# Altium schematic sheet CW308T_XMEGA_Connector.SchDoc: CW308 Connections
size Letter; Organization: NewAE Technology Inc.; Address1: 1083 Queen St., Suite 196; Address2: Halifax; Address3: NS; Address4: Canada B3H 0B2; SheetNumber: 2; SheetTotal: 2; SheetApproved: YES
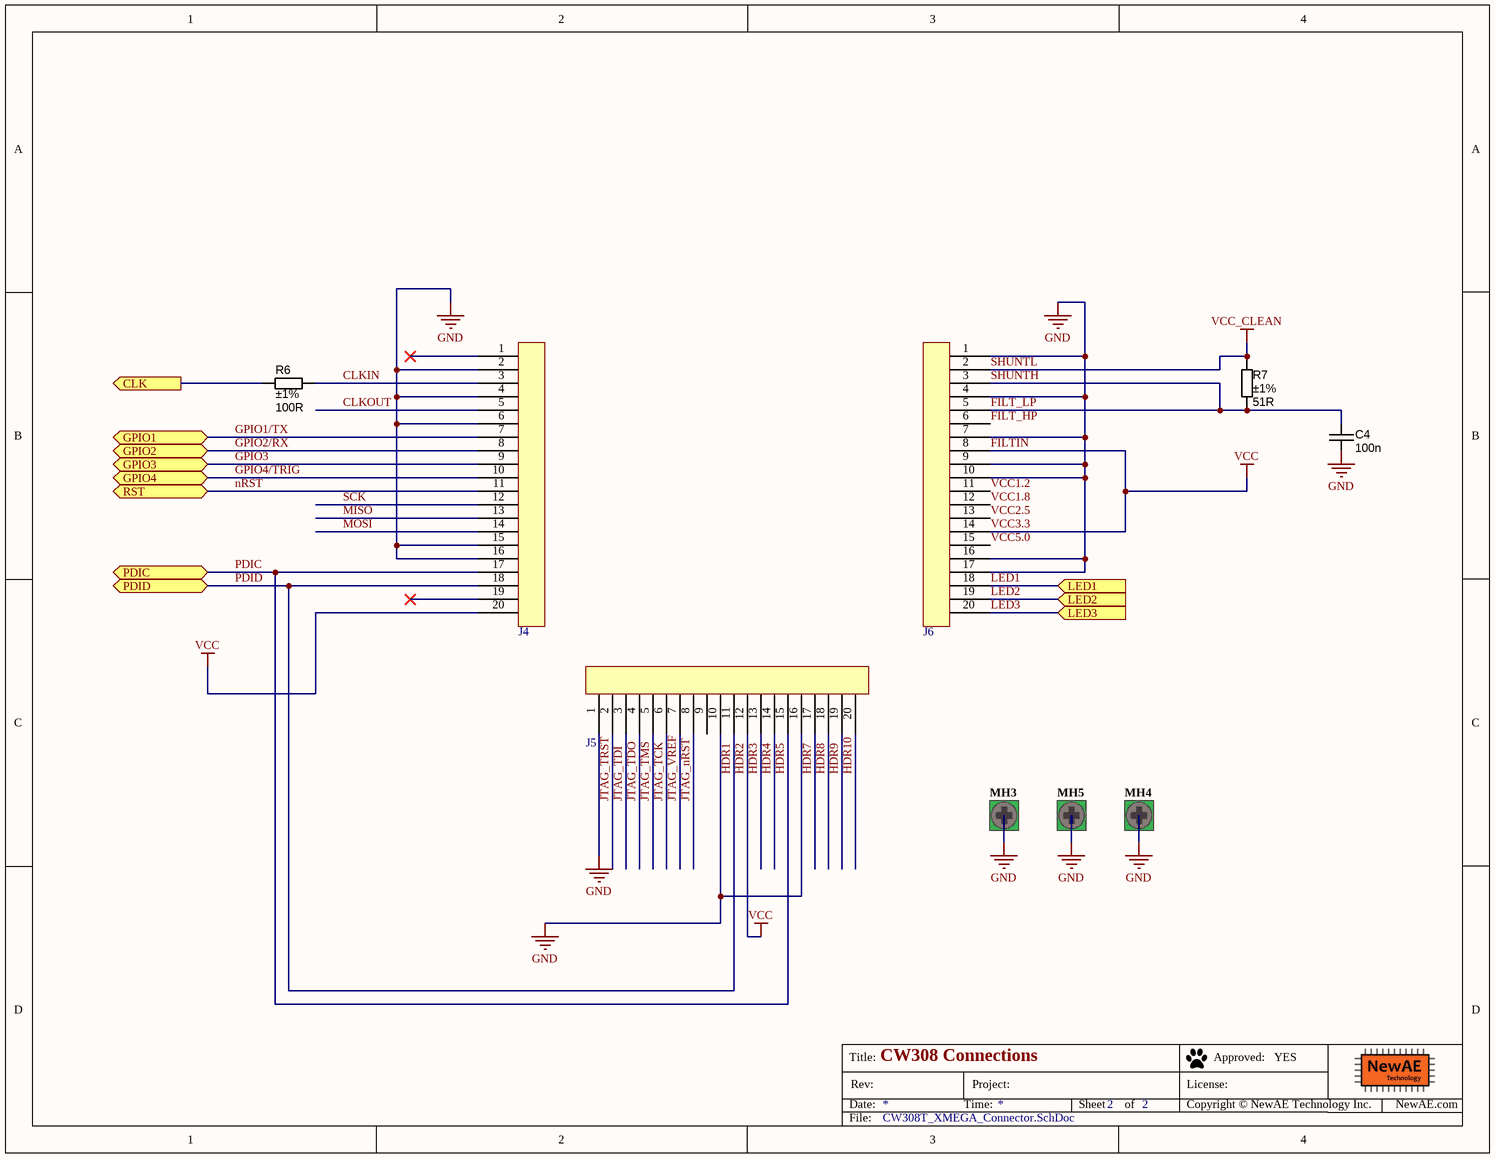
[diagram p0: CW308T_XMEGA_Connector.SchDoc]

## Parts
C4  value 100n  [CAPC1608X90N]  (hidden comment: approved sub OK)
J4  20-Pin Header  [801-87-020-10-001101]  (value not drawn)
J5  20-Pin Header  [801-87-020-10-001101]  (value not drawn)
J6  20-Pin Header  [801-87-020-10-001101]  (value not drawn)
MH3  Mounting-Hole-RND-Altium  [Mounting-Hole-RND-Altium]  (value not drawn)  (no BOM)
MH4  Mounting-Hole-RND-Altium  [Mounting-Hole-RND-Altium]  (value not drawn)  (no BOM)
MH5  Mounting-Hole-RND-Altium  [Mounting-Hole-RND-Altium]  (value not drawn)  (no BOM)
R6  value 100R  Tolerance: ±1%  [RESC1608X55N]  (hidden comment: Thick Film)
R7  value 51R  Tolerance: ±1%  [RESC1608X55N]  (hidden comment: Thick Film)

## Ports
CLK (out), GPIO1 (bidir), GPIO2 (bidir), GPIO3 (bidir), GPIO4 (bidir), LED1 (in), LED2 (in), LED3 (in), PDIC (bidir), PDID (bidir), RST (bidir)

## Nets
FILTIN: J4.20 J5.12 J6.8 J6.14  [also labelled HDR2, VCC, VCC3.3]
GND: C4.2 J4.2 J4.4 J4.6 J4.15 J4.16 J5.1 J5.10 J5.16 J6.1 J6.4 J6.7 J6.9 J6.10 J6.16 J6.17 MH3.1 MH4.1 MH5.1
SHUNTL: J6.2 R7.1  [also labelled VCC_CLEAN]
CLK: R6.1 ; port CLK
CLKIN: J4.3 R6.2
CLKOUT: J4.5
FILT_HP: J6.6
FILT_LP: C4.1 J6.3 J6.5 R7.2  [also labelled SHUNTH]
GPIO1/TX: J4.7 ; port GPIO1
GPIO2/RX: J4.8 ; port GPIO2
GPIO3: J4.9 ; port GPIO3
GPIO4/TRIG: J4.10 ; port GPIO4
HDR1: J4.18 J5.11 ; port PDID  [also labelled PDID]
HDR3: J5.13
HDR4: J5.14
HDR5: J4.17 J5.15 ; port PDIC  [also labelled PDIC]
HDR7: J5.17
HDR8: J5.18
HDR9: J5.19
HDR10: J5.20
JTAG_nRST: J5.8
JTAG_TCK: J5.6
JTAG_TDI: J5.3
JTAG_TDO: J5.4
JTAG_TMS: J5.5
JTAG_TRST: J5.2
JTAG_VREF: J5.7
LED1: J6.18 ; port LED1
LED2: J6.19 ; port LED2
LED3: J6.20 ; port LED3
MISO: J4.13
MOSI: J4.14
nRST: J4.11 ; port RST
SCK: J4.12
VCC1.2: J6.11
VCC1.8: J6.12
VCC2.5: J6.13
VCC5.0: J6.15

Not connected (* = marked no-connect by the designer): J4 1* 19*; J5 9

## Notes on the sheet
- Title:
- Date:
- Rev:
- Time:
- Project:
- Sheet
- of
- License:
- Copyright © NewAE Technology Inc.
- Approved:
- NewAE.com
- File:

## Library data of the parts
C4 = CAPC_100n_0603_X7R_50V_10%: Capacitor SMD Cer 100nF 10% 50V X7R 0603; Manufacturer 1: AVX Corporation; Manufacturer Part Number 1: 06035C104KAT2A; Ratings: 50V; X7R; Material: ceramic; SCDType: spec; Manufacturer 2: TDK Corporation; Manufacturer Part Number 2: C1608X7R1H104K; Package / Case: 0603 (1608 Metric); Tolerance: ±10%; Supplier 1: Digi-Key; Supplier Part Number 1: 478-5052-1-ND; ComponentLink1URL: http://www.avx.com/docs/Catalogs/cx7r.pdf; ComponentLink1Description: http://www.avx.com/docs/Catalogs/cx7r.pdf; Supplier 2: Digi-Key; Supplier Part Number 2: 445-1314-1-ND; ComponentLink2URL: http://product.tdk.com/capacitor/mlcc/en/documents/mlcc_commercial_general_en.pdf; ComponentLink2Description: http://product.tdk.com/capacitor/mlcc/en/documents/mlcc_commercial_general_en.pdf
J4-J6 = 801-87-020-10-001101: 1x20 Header, Machined; Manufacture 1: Preci-Dip SA; Manufacture Part Number 1: 801-87-020-10-001101; Supplier 1: Digi-Key; Supplier Part Number 1: 1212-1207-ND
MH3-MH5 = CMP-0001-00029-1: Mounting Hole, Altium, 4.4mm pad, 3.4mm plated hole; Publisher: Altium; ClassName: Mounting Hole
R6 = RES_100R_0603_1%: Resistor SMD chip 100 Ohm 0.1W 1% 0603; Manufacturer 1: Yageo; Manufacturer Part Number 1: RC0603FR-07100RL; Ratings: 1/10 W; SCDType: spec; Package / Case: 0603 (1608 Metric); Material: Thick Film; Supplier 1: Digi-Key; Supplier Part Number 1: 311-100HRCT-ND; Supplier 2: Digi-Key; Supplier Part Number 2: P100HTR-ND; Manufacturer 2: Panasonic - ECG; Manufacturer Part Number 2: ERJ-3EKF1000V; ComponentLink1URL: http://industrial.panasonic.com/www-cgi/jvcr13pz.cgi?E+PZ+3+AOA0002+ERJ3EKF1000V+7+WW; ComponentLink1Description: http://industrial.panasonic.com/www-cgi/jvcr13pz.cgi?E+PZ+3+AOA0002+ERJ3EKF1000V+7+WW
R7 = RES_51R_0603_1%: Resistor SMD chip 51 Ohm 0.1W 1% 0603; Manufacturer 1: Yageo; Manufacturer Part Number 1: RC0603FR-0751RL; Ratings: 1/10 W; SCDType: spec; Package / Case: 0603 (1608 metric); Supplier 1: Digi-Key; Supplier Part Number 1: 311-51.0HRCT-ND; Material: Thick Film